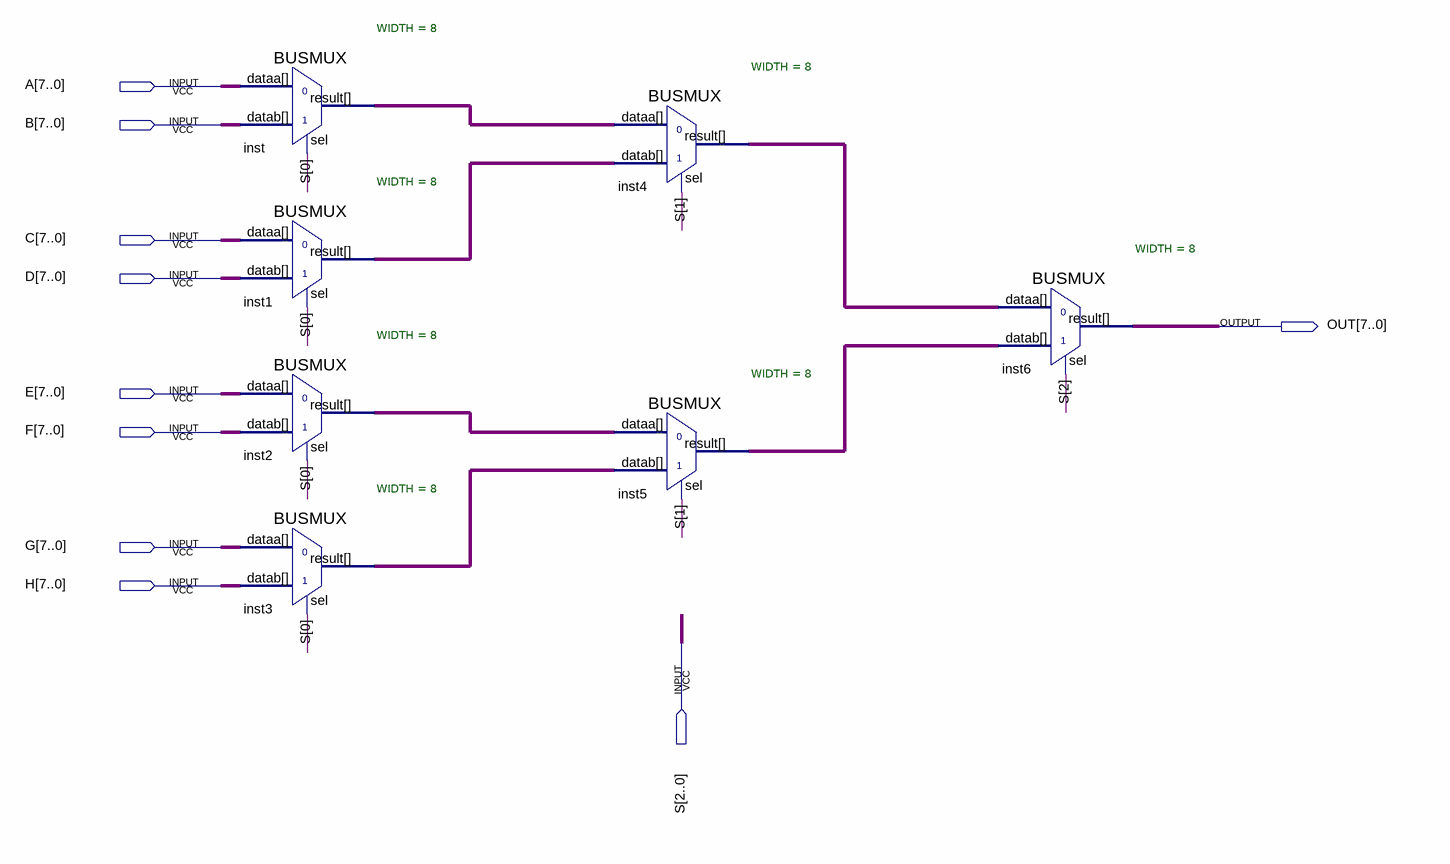
[diagram p0: schematic sheet]
// Quartus schematic EightToOneMux.bdf as structural Verilog: 7 symbols, 10 pins
module EightToOneMux (
  input  [7:0] A,
  input  [7:0] B,
  input  [7:0] C,
  input  [7:0] D,
  input  [7:0] E,
  input  [7:0] F,
  input  [7:0] G,
  input  [7:0] H,
  input  [2:0] S,
  output [7:0] OUT
);

  wire [7:0] inst1_result, inst2_result, inst3_result, inst4_result, inst5_result, inst_result;

  BUSMUX #(.WIDTH(8)) inst (.datab(B), .sel(S[0]), .dataa(A), .result(inst_result));
  BUSMUX #(.WIDTH(8)) inst1 (.datab(D), .sel(S[0]), .dataa(C), .result(inst1_result));
  BUSMUX #(.WIDTH(8)) inst2 (.datab(F), .sel(S[0]), .dataa(E), .result(inst2_result));
  BUSMUX #(.WIDTH(8)) inst3 (.datab(H), .sel(S[0]), .dataa(G), .result(inst3_result));
  BUSMUX #(.WIDTH(8)) inst4 (.datab(inst1_result), .sel(S[1]), .dataa(inst_result), .result(inst4_result));
  BUSMUX #(.WIDTH(8)) inst5 (.datab(inst3_result), .sel(S[1]), .dataa(inst2_result), .result(inst5_result));
  BUSMUX #(.WIDTH(8)) inst6 (.datab(inst5_result), .sel(S[2]), .dataa(inst4_result), .result(OUT));
endmodule
